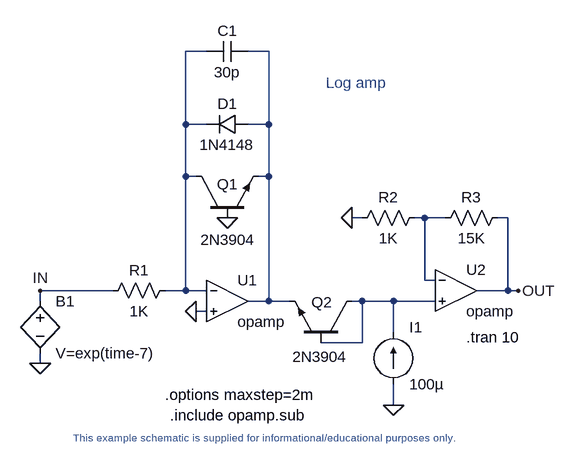
[diagram p0: schematic logamp.asc]
logamp.asc, the LTspice schematic file:
Version 4
SHEET 1 5945676 13421556
WIRE 1472 -304 1440 -304
WIRE 1568 -304 1536 -304
WIRE 1440 -192 1440 -304
WIRE 1472 -192 1440 -192
WIRE 1568 -192 1568 -304
WIRE 1568 -192 1536 -192
WIRE 1440 -112 1440 -192
WIRE 1456 -112 1440 -112
WIRE 1568 -112 1568 -192
WIRE 1568 -112 1552 -112
WIRE 1712 -48 1696 -48
WIRE 1808 -48 1792 -48
WIRE 1840 -48 1808 -48
WIRE 1936 -48 1920 -48
WIRE 1808 48 1808 -48
WIRE 1824 48 1808 48
WIRE 1328 64 1216 64
WIRE 1440 64 1440 -112
WIRE 1440 64 1408 64
WIRE 1472 64 1440 64
WIRE 1936 64 1936 -48
WIRE 1936 64 1888 64
WIRE 1952 64 1936 64
WIRE 1216 80 1216 64
WIRE 1568 80 1568 -112
WIRE 1568 80 1536 80
WIRE 1600 80 1568 80
WIRE 1712 80 1696 80
WIRE 1760 80 1712 80
WIRE 1824 80 1760 80
WIRE 1472 96 1456 96
WIRE 1760 128 1760 80
WIRE 1712 144 1712 80
WIRE 1712 144 1648 144
WIRE 1216 176 1216 160
WIRE 1760 240 1760 208
FLAG 1216 176 0
FLAG 1504 -48 0
FLAG 1456 96 0
FLAG 1760 240 0
FLAG 1696 -48 0
FLAG 1952 64 OUT
FLAG 1216 64 IN
SYMBOL RES 1424 48 R90
WINDOW 0 0 56 VBottom 2
WINDOW 3 32 56 VTop 2
SYMATTR InstName R1
SYMATTR Value 1K
SYMBOL OPAMPS\\OPAMP 1504 16 R0
SYMATTR InstName U1
SYMBOL OPAMPS\\OPAMP 1856 0 R0
SYMATTR InstName U2
SYMBOL cap 1536 -320 R90
WINDOW 0 0 32 VBottom 2
WINDOW 3 32 32 VTop 2
SYMATTR InstName C1
SYMATTR Value 30p
SYMBOL diode 1536 -208 R90
WINDOW 0 0 32 VBottom 2
WINDOW 3 32 32 VTop 2
SYMATTR InstName D1
SYMATTR Value 1N4148
SYMBOL NPN 1456 -48 R270
WINDOW 0 52 48 VCenter 2
WINDOW 3 -34 49 VCenter 2
SYMATTR InstName Q1
SYMATTR Value 2N3904
SYMBOL npn 1696 144 M270
WINDOW 0 62 46 VCenter 2
WINDOW 3 -22 49 VCenter 2
SYMATTR InstName Q2
SYMATTR Value 2N3904
SYMBOL CURRENT 1760 208 M180
WINDOW 0 24 88 Left 2
WINDOW 3 24 0 Left 2
SYMATTR InstName I1
SYMATTR Value 100µ
SYMBOL res 1808 -64 R90
WINDOW 0 0 56 VBottom 2
WINDOW 3 32 56 VTop 2
SYMATTR InstName R2
SYMATTR Value 1K
SYMBOL res 1936 -64 R90
WINDOW 0 0 56 VBottom 2
WINDOW 3 32 56 VTop 2
SYMATTR InstName R3
SYMATTR Value 15K
SYMBOL BV 1216 64 R0
SYMATTR InstName B1
SYMATTR Value V=exp(time-7)
TEXT 1872 136 Left 2 !.tran 10
TEXT 1416 256 Left 2 !.include opamp.sub
TEXT 1408 224 Left 2 !.options maxstep=2m
TEXT 1656 -256 Left 2 ;Log amp
TEXT 1552 280 Top 1 ;This example schematic is supplied for informational/educational purposes only.

The netlist it stands for:
* logamp.asc
R1 N001 IN 1K
XU1 N001 0 N002 opamp Aol=100K GBW=10Meg  ; pins invin noninvin out
XU2 N003 N004 OUT opamp Aol=100K GBW=10Meg  ; pins invin noninvin out
C1 N002 N001 30p
D1 N002 N001 1N4148
Q1 N001 0 N002 0 2N3904
Q2 N004 N004 N002 0 2N3904
I1 0 N004 100µ
R2 N003 0 1K
R3 OUT N003 15K
B1 IN 0 V=exp(time-7)
.model D D
.lib standard.dio
.model NPN NPN
.model PNP PNP
.lib standard.bjt
.tran 10
.include opamp.sub
.options maxstep=2m
* Log amp
* This example schematic is supplied for informational/educational purposes only.
.backanno
.end